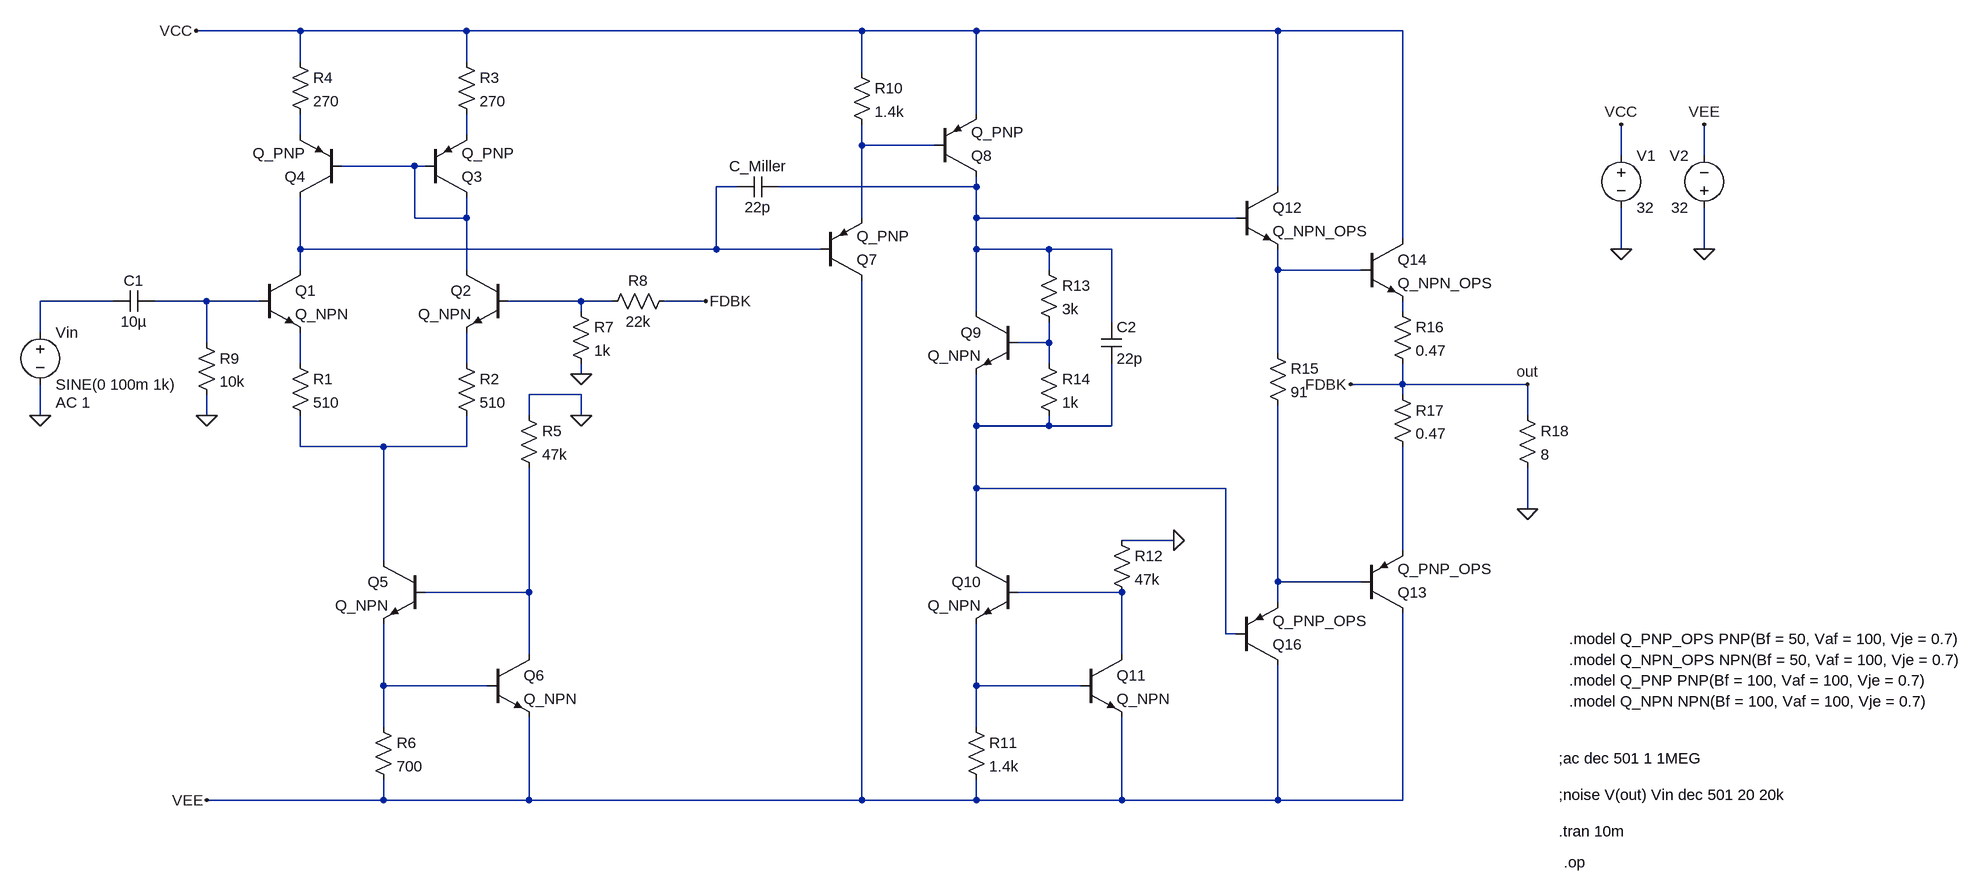
[diagram p0: schematic PowerAmplifier.asc]
PowerAmplifier.asc, the LTspice schematic file:
Version 4
SHEET 1 1656 1040
WIRE -944 -320 -1104 -320
WIRE -688 -320 -944 -320
WIRE -80 -320 -688 -320
WIRE 96 -320 -80 -320
WIRE 560 -320 96 -320
WIRE 752 -320 560 -320
WIRE -944 -272 -944 -320
WIRE -688 -272 -688 -320
WIRE -80 -256 -80 -320
WIRE 96 -192 96 -320
WIRE -944 -160 -944 -192
WIRE -688 -160 -688 -192
WIRE -80 -144 -80 -176
WIRE 32 -144 -80 -144
WIRE 1088 -128 1088 -176
WIRE 1216 -128 1216 -176
WIRE -768 -112 -880 -112
WIRE -752 -112 -768 -112
WIRE -272 -80 -304 -80
WIRE 96 -80 96 -96
WIRE 96 -80 -208 -80
WIRE 560 -80 560 -320
WIRE -768 -32 -768 -112
WIRE -688 -32 -688 -64
WIRE -688 -32 -768 -32
WIRE -80 -32 -80 -144
WIRE 96 -32 96 -80
WIRE 496 -32 96 -32
WIRE 752 0 752 -320
WIRE -944 16 -944 -64
WIRE -304 16 -304 -80
WIRE -304 16 -944 16
WIRE -144 16 -304 16
WIRE 96 16 96 -32
WIRE 208 16 96 16
WIRE 304 16 208 16
WIRE 1088 16 1088 -48
WIRE 1216 16 1216 -48
WIRE -944 48 -944 16
WIRE -688 48 -688 -32
WIRE 208 48 208 16
WIRE 560 48 560 16
WIRE 688 48 560 48
WIRE -1232 96 -1344 96
WIRE -1088 96 -1168 96
WIRE -1008 96 -1088 96
WIRE -512 96 -624 96
WIRE -464 96 -512 96
WIRE -320 96 -384 96
WIRE -512 112 -512 96
WIRE 96 112 96 16
WIRE 752 112 752 96
WIRE 304 128 304 16
WIRE -1344 144 -1344 96
WIRE -1088 160 -1088 96
WIRE 208 160 208 128
WIRE 208 160 160 160
WIRE 560 176 560 48
WIRE -944 192 -944 144
WIRE -688 192 -688 144
WIRE 208 192 208 160
WIRE -512 208 -512 192
WIRE 752 224 752 192
WIRE 752 224 672 224
WIRE 944 224 752 224
WIRE -512 240 -592 240
WIRE 752 240 752 224
WIRE -1344 272 -1344 224
WIRE -1088 272 -1088 240
WIRE -592 272 -592 240
WIRE -512 272 -512 240
WIRE 944 272 944 224
WIRE 96 288 96 208
WIRE 208 288 208 272
WIRE 208 288 96 288
WIRE 304 288 304 192
WIRE 304 288 208 288
WIRE -944 320 -944 272
WIRE -816 320 -944 320
WIRE -688 320 -688 272
WIRE -688 320 -816 320
WIRE 96 384 96 288
WIRE 480 384 96 384
WIRE 944 416 944 352
WIRE 400 464 320 464
WIRE 752 480 752 320
WIRE -816 496 -816 320
WIRE 96 496 96 384
WIRE 560 528 560 256
WIRE 688 528 560 528
WIRE -592 544 -592 352
WIRE -592 544 -752 544
WIRE 320 544 160 544
WIRE 560 560 560 528
WIRE 480 608 480 384
WIRE 496 608 480 608
WIRE -592 640 -592 544
WIRE 320 640 320 544
WIRE -816 688 -816 592
WIRE -656 688 -816 688
WIRE 96 688 96 592
WIRE 256 688 96 688
WIRE -816 752 -816 688
WIRE 96 752 96 688
WIRE -816 864 -816 832
WIRE -816 864 -1088 864
WIRE -592 864 -592 736
WIRE -592 864 -816 864
WIRE -80 864 -80 64
WIRE -80 864 -592 864
WIRE 96 864 96 832
WIRE 96 864 -80 864
WIRE 320 864 320 736
WIRE 320 864 96 864
WIRE 560 864 560 656
WIRE 560 864 320 864
WIRE 752 864 752 576
WIRE 752 864 560 864
FLAG -512 272 0
FLAG -512 208 0
FLAG -320 96 FDBK
FLAG -1088 272 0
FLAG -1344 272 0
FLAG 400 464 0
FLAG 672 224 FDBK
FLAG 1216 16 0
FLAG 1088 16 0
FLAG 1088 -176 VCC
FLAG -1104 -320 VCC
FLAG 1216 -176 VEE
FLAG -1088 864 VEE
FLAG 944 416 0
FLAG 944 224 out
DATAFLAG 752 224 ""
DATAFLAG 560 96 ""
DATAFLAG 560 464 ""
DATAFLAG 560 464 ""
SYMBOL npn -1008 48 R0
SYMATTR InstName Q1
SYMATTR Value Q_NPN
SYMBOL npn -624 48 M0
SYMATTR InstName Q2
SYMATTR Value Q_NPN
SYMBOL pnp -752 -64 M180
SYMATTR InstName Q3
SYMATTR Value Q_PNP
SYMBOL pnp -880 -64 R180
SYMATTR InstName Q4
SYMATTR Value Q_PNP
SYMBOL res -704 176 R0
SYMATTR InstName R2
SYMATTR Value 510
SYMBOL res -960 176 R0
SYMATTR InstName R1
SYMATTR Value 510
SYMBOL res -704 -288 R0
SYMATTR InstName R3
SYMATTR Value 270
SYMBOL res -960 -288 R0
SYMATTR InstName R4
SYMATTR Value 270
SYMBOL npn -752 496 M0
SYMATTR InstName Q5
SYMATTR Value Q_NPN
SYMBOL npn -656 640 R0
SYMATTR InstName Q6
SYMATTR Value Q_NPN
SYMBOL res -608 256 R0
SYMATTR InstName R5
SYMATTR Value 47k
SYMBOL res -832 736 R0
SYMATTR InstName R6
SYMATTR Value 700
SYMBOL res -528 96 R0
SYMATTR InstName R7
SYMATTR Value 1k
SYMBOL res -368 80 R90
WINDOW 0 0 56 VBottom 2
WINDOW 3 32 56 VTop 2
SYMATTR InstName R8
SYMATTR Value 22k
SYMBOL res -1104 144 R0
SYMATTR InstName R9
SYMATTR Value 10k
SYMBOL cap -1168 80 R90
WINDOW 0 0 32 VBottom 2
WINDOW 3 32 32 VTop 2
SYMATTR InstName C1
SYMATTR Value 10µ
SYMBOL voltage -1344 128 R0
WINDOW 123 24 124 Left 2
WINDOW 39 0 0 Left 0
SYMATTR Value2 AC 1
SYMATTR InstName Vin
SYMATTR Value SINE(0 100m 1k)
SYMBOL pnp -144 64 M180
SYMATTR InstName Q7
SYMATTR Value Q_PNP
SYMBOL pnp 32 -96 M180
SYMATTR InstName Q8
SYMATTR Value Q_PNP
SYMBOL res -96 -272 R0
SYMATTR InstName R10
SYMATTR Value 1.4k
SYMBOL cap -208 -96 R90
WINDOW 0 0 32 VBottom 2
WINDOW 3 32 32 VTop 2
SYMATTR InstName C_Miller
SYMATTR Value 22p
SYMBOL npn 160 112 M0
SYMATTR InstName Q9
SYMATTR Value Q_NPN
SYMBOL npn 160 496 M0
SYMATTR InstName Q10
SYMATTR Value Q_NPN
SYMBOL npn 256 640 R0
SYMATTR InstName Q11
SYMATTR Value Q_NPN
SYMBOL res 80 736 R0
SYMATTR InstName R11
SYMATTR Value 1.4k
SYMBOL res 304 448 R0
SYMATTR InstName R12
SYMATTR Value 47k
SYMBOL res 192 32 R0
SYMATTR InstName R13
SYMATTR Value 3k
SYMBOL res 192 176 R0
SYMATTR InstName R14
SYMATTR Value 1k
SYMBOL cap 288 128 R0
SYMATTR InstName C2
SYMATTR Value 22p
SYMBOL npn 496 -80 R0
SYMATTR InstName Q12
SYMATTR Value Q_NPN_OPS
SYMBOL res 544 160 R0
SYMATTR InstName R15
SYMATTR Value 91
SYMBOL npn 688 0 R0
SYMATTR InstName Q14
SYMATTR Value Q_NPN_OPS
SYMBOL pnp 496 656 M180
SYMATTR InstName Q16
SYMATTR Value Q_PNP_OPS
SYMBOL res 736 96 R0
SYMATTR InstName R16
SYMATTR Value 0.47
SYMBOL res 736 224 R0
SYMATTR InstName R17
SYMATTR Value 0.47
SYMBOL pnp 688 576 M180
SYMATTR InstName Q13
SYMATTR Value Q_PNP_OPS
SYMBOL voltage 1088 -144 R0
SYMATTR InstName V1
SYMATTR Value 32
SYMBOL voltage 1216 -32 R180
WINDOW 0 24 96 Left 2
WINDOW 3 24 16 Left 2
SYMATTR InstName V2
SYMATTR Value 32
SYMBOL res 928 256 R0
SYMATTR InstName R18
SYMATTR Value 8
TEXT 1008 712 Left 2 !.model Q_NPN NPN(Bf = 100, Vaf = 100, Vje = 0.7)
TEXT 1008 680 Left 2 !.model Q_PNP PNP(Bf = 100, Vaf = 100, Vje = 0.7)
TEXT 1008 648 Left 2 !.model Q_NPN_OPS NPN(Bf = 50, Vaf = 100, Vje = 0.7)
TEXT 1008 616 Left 2 !.model Q_PNP_OPS PNP(Bf = 50, Vaf = 100, Vje = 0.7)
TEXT 992 912 Left 2 !.tran 10m
TEXT 1000 960 Left 2 !.op
TEXT 992 800 Left 2 !;ac dec 501 1 1MEG
TEXT 992 856 Left 2 !;noise V(out) Vin dec 501 20 20k

The netlist it stands for:
* PowerAmplifier.asc
Q1 N005 N009 N013 0 Q_NPN
Q2 N004 N010 N014 0 Q_NPN
Q3 N004 N004 N002 0 Q_PNP
Q4 N005 N004 N001 0 Q_PNP
R2 N014 N016 510
R1 N013 N016 510
R3 VCC N002 270
R4 VCC N001 270
Q5 N016 N019 N021 0 Q_NPN
Q6 N019 N021 VEE 0 Q_NPN
R5 0 N019 47k
R6 N021 VEE 700
R7 N010 0 1k
R8 out N010 22k
R9 N009 0 10k
C1 N009 N008 10µ
Vin N008 0 SINE(0 100m 1k) AC 1
Q7 VEE N005 N003 0 Q_PNP
Q8 N006 N003 VCC 0 Q_PNP
R10 VCC N003 1.4k
C_Miller N006 N005 22p
Q9 N006 N012 N015 0 Q_NPN
Q10 N015 N020 N022 0 Q_NPN
Q11 N020 N022 VEE 0 Q_NPN
R11 N022 VEE 1.4k
R12 0 N020 47k
R13 N006 N012 3k
R14 N012 N015 1k
C2 N006 N015 22p
Q12 VCC N006 N007 0 Q_NPN_OPS
R15 N007 N018 91
Q14 VCC N007 N011 0 Q_NPN_OPS
Q16 VEE N015 N018 0 Q_PNP_OPS
R16 N011 out 0.47
R17 out N017 0.47
Q13 VEE N018 N017 0 Q_PNP_OPS
V1 VCC 0 32
V2 0 VEE 32
R18 out 0 8
.model NPN NPN
.model PNP PNP
.lib standard.bjt
.model Q_NPN NPN(Bf = 100, Vaf = 100, Vje = 0.7)
.model Q_PNP PNP(Bf = 100, Vaf = 100, Vje = 0.7)
.model Q_NPN_OPS NPN(Bf = 50, Vaf = 100, Vje = 0.7)
.model Q_PNP_OPS PNP(Bf = 50, Vaf = 100, Vje = 0.7)
.tran 10m
.op
;ac dec 501 1 1MEG
;noise V(out) Vin dec 501 20 20k
.backanno
.end